# Altium schematic sheet 5_LCD.SchDoc
size A; SheetNumber: 5; SheetTotal: 5
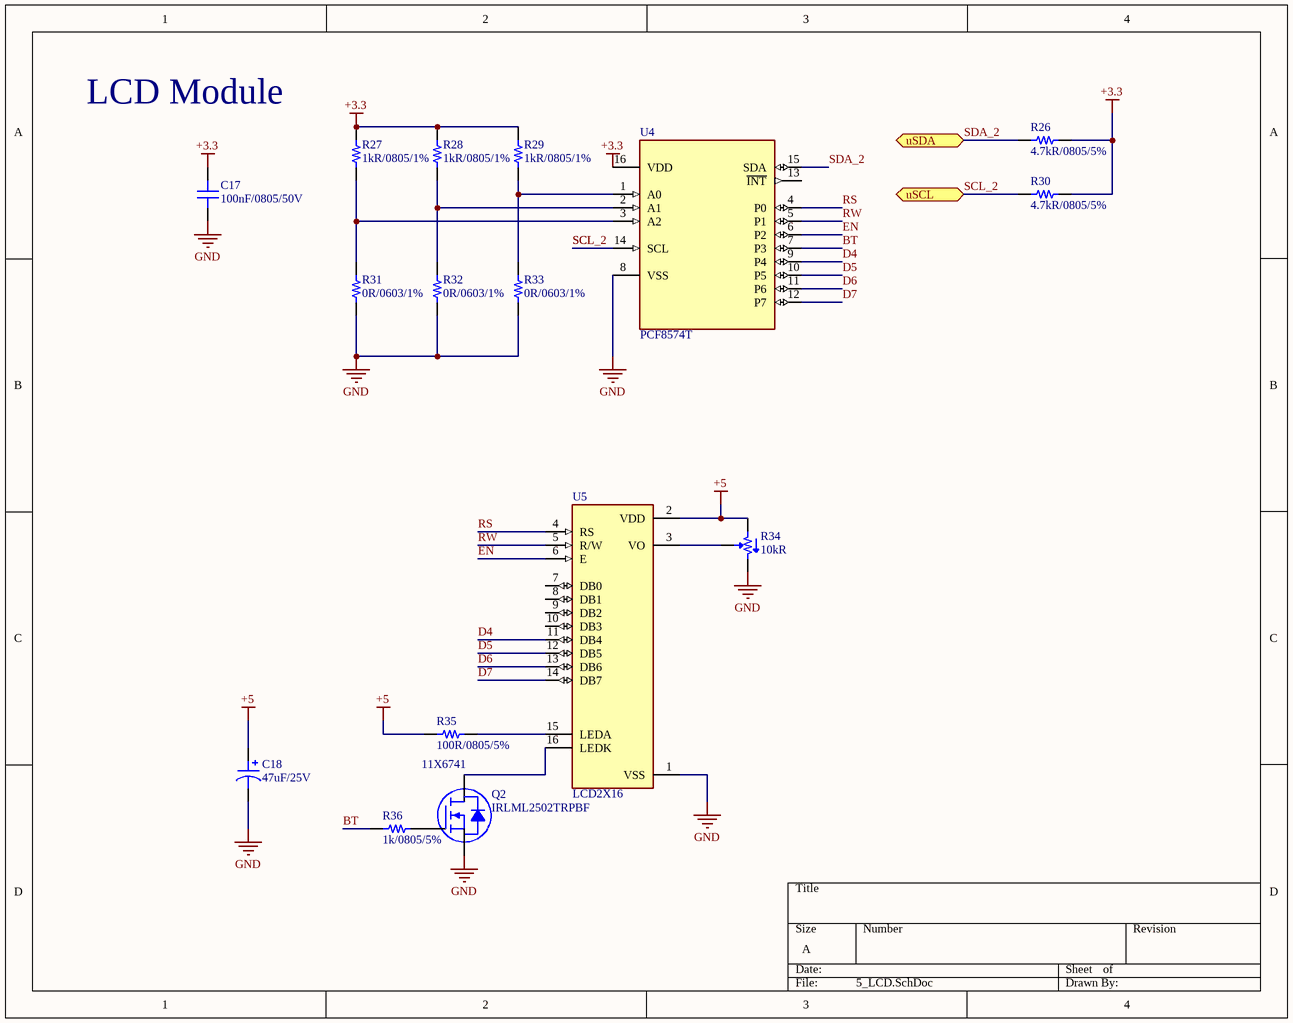
[diagram p0: 5_LCD.SchDoc]

## Parts
C17  100nF/0805/50V  [CAP FILM 0805]
C18  47uF/25V  [CAP ALSMD 6.6MM H5.4MM]
Q2  IRLML2502TRPBF  Supplier Part Number 1: 11X6741  [TI SOT-23-3 DBZ]
R26  4.7kR/0805/5%  [RES 0805_2012]
R27  1kR/0805/1%  [RES 0805_2012]
R28  1kR/0805/1%  [RES 0805_2012]
R29  1kR/0805/1%  [RES 0805_2012]
R30  4.7kR/0805/5%  [RES 0805_2012]
R31  0R/0603/1%  [RES 0603_1608]
R32  0R/0603/1%  [RES 0603_1608]
R33  0R/0603/1%  [RES 0603_1608]
R34  10kR  [POT Panasonic EVM]
R35  100R/0805/5%  [RES 0805_2012]
R36  1k/0805/5%  [RES 0805_2012]
U4  PCF8574T  [SOIC127P1032X265-16N]
U5  LCD2X16  [LCD_LCD2X16]

## Ports
uSCL (bidir), uSDA (bidir)

## Nets
+3.3: C17.2 R26.2 R27.2 R28.2 R29.2 R30.2 U4.16(VDD)
+5: C18.1 R34.1 R35.1 U5.2(VDD)
GND: C17.1 C18.2 Q2.2(S) R31.1 R32.1 R33.1 R34.3 U4.8(VSS) U5.1(VSS)
BT: R36.2 U4.7(P3)
D4: U4.9(P4) U5.11(DB4)
D5: U4.10(P5) U5.12(DB5)
D6: U4.11(P6) U5.13(DB6)
D7: U4.12(P7) U5.14(DB7)
EN: U4.6(P2) U5.6(E)
RS: U4.4(P0) U5.4(RS)
RW: U4.5(P1) U5.5(R/W)
SCL: R30.1 U4.14(SCL) ; port uSCL  [also labelled SCL_2]
SDA_2: R26.1 U4.15(SDA) ; port uSDA
NetQ2_1: Q2.1(G) R36.1
NetQ2_3: Q2.3(D) U5.16(LEDK)
NetR27_1: R27.1 R31.2 U4.3(A2)
NetR28_1: R28.1 R32.2 U4.2(A1)
NetR29_1: R29.1 R33.2 U4.1(A0)
NetR34_2: R34.2 U5.3(VO)
NetR35_2: R35.2 U5.15(LEDA)

Not connected (* = marked no-connect by the designer): U4 13(~{INT}); U5 7(DB0) 8(DB1) 9(DB2) 10(DB3)

## Notes on the sheet
- LCD Module

## Library data of the parts
C17 = Capacitor - MLCC: Multilayer Ceramic Capacitor, 0.1 uF, 50 V, ï¿½ 10%, X7R, 0805 [2012 Metric]; Manufacturer: Samsung; Manufacturer Part Number: CL21B104KBCNNNC; Capacitance: 100nF; Voltage Rating: 50V; Supplier 1: Avnet; Supplier Part Number 1: CL21B104KBCNNNC; RoHS: Yes; Category: Ceramic Capacitors; Stock 1: 850000; Pricing 1: 4000=0.0097, 8000=0.00455, 16000=0.00444, 24000=0.00434, 32000=0.00423 (USD); Mount: Surface Mount; Case/Package: 0805; Case Code (Metric): 2012; Case Code (Imperial): 0805; Material: Ceramic; Min Operating Temperature: -55°C; Max Operating Temperature: 125°C; Tolerance: 10%; Dielectric: X7R; Packaging: Tape and Reel; Voltage: 50V; Series: CL; Construction: Flat; Voltage Rating (DC): 50V; Length: 2mm; Width: 0.049inch; Height: 0.85mm; Depth: 1.25mm; Thickness: 0.037inch; Radiation Hardening: No; RoHS Compliant: Yes; Lead Free: 5697LeadFree; ComponentLink1URL: https://datasheet.ciiva.com/25710/cl21b104kbcnnnc-25710182.pdf?src-supplier=Digikey; ComponentLink1Description: https://datasheet.ciiva.com/25710/cl21b104kbcnnnc-25710182.pdf?src-supplier=Digikey; ComponentLink2URL: https://datasheet.ciiva.com/29199/454152-da-01-en-vs-kondensator-0805-29199814.pdf?src-supplier=Conrad; ComponentLink2Description: https://datasheet.ciiva.com/29199/454152-da-01-en-vs-kondensator-0805-29199814.pdf?src-supplier=Conrad
C18 = Capacitor - Aluminum: SMT Polarised Capacitor
Q2 = MOSFET N-CH: Mosfet, Power; N-ch; Vdss 20V; Rds(on) 0.035 Ohm; Id 4.2A; MICRO3; Pd 1.25W; Vgs +/-12V; Manufacturer: International Rectifier; Nominal Vgs: 1.2V; Drain-source On Resistance-Max: 45mR; Supplier 1: Newark; Manufacturer Part Number: IRLML2502TRPBF; RoHS: Yes; Category: Uncategorized; Case/Package: SOT-23; Number of Pins: 3; Min Operating Temperature: -55°C; Max Operating Temperature: 150°C; Drain to Source Voltage (Vdss): 20V; Continuous Drain Current (ID): 4.2A; Voltage Rating (DC): 20V; Current Rating: 4.2A; Dual Supply Voltage: 20V; Threshold Voltage: 1.2V; Termination: SMD/SMT; Max Power Dissipation: 1.25W; RoHS Compliant: Yes; Lead Free: Lead Free; Reach SVHC Compliant: No; ComponentLink1URL: https://datasheet.ciiva.com/36526/1563649-36526014.pdf?src-supplier=Jameco; ComponentLink1Description: https://datasheet.ciiva.com/36526/1563649-36526014.pdf?src-supplier=Jameco; ComponentLink2URL: https://datasheet.ciiva.com/16425/irlml2502pbf-16425943.pdf?src-supplier=Future+Electronics; ComponentLink2Description: https://datasheet.ciiva.com/16425/irlml2502pbf-16425943.pdf?src-supplier=Future+Electronics; ComponentLink3URL: https://datasheet.ciiva.com/6156/irlml2502-6156070.pdf?src-supplier=Farnell; ComponentLink3Description: https://datasheet.ciiva.com/6156/irlml2502-6156070.pdf?src-supplier=Farnell; ComponentLink4URL: https://datasheet.ciiva.com/7935/irlml2502-7935685.pdf?src-supplier=Element14; ComponentLink4Description: https://datasheet.ciiva.com/7935/irlml2502-7935685.pdf?src-supplier=Element14
R26 R30 = Resistor: SMD Chip Resistor, 4.7 kOhm, ± 5%, 125 mW, 0805 [2012 Metric], Thick Film, General Purpose; Manufacturer: Vishay Dale; Manufacturer Part Number: CRCW08054K70JNEA; Resistance: 4.7kR; Power Rating: 125mW; Voltage Rating: 150V; Temperature Coefficient: 200ppm/°C; Supplier 1: Mouser; Supplier Part Number 1: 71-CRCW0805J-4.7K-E3; RoHS: Yes; Category: Chip SMD Resistors; Stock 1: 11837; Pricing 1: 1=0.1, 10=0.022, 50=0.022, 100=0.015, 1000=0.012, 10000=0.005 (USD); Case/Package: 0805; Weight: 0.000194oz; Case Code (Imperial): 0805; Case Code (Metric): 2012; Contact Plating: Tin; Size Code: 0805; Min Operating Temperature: -55°C; Max Operating Temperature: 155°C; Packaging: Tape and Reel; Tolerance: 5%; Package Quantity: 5000; Termination: SMD/SMT; Features: Automotive AEC-Q200; Series: CRCW; Max Power Dissipation: 125mW; Number of Terminations: 2; Resistor Type: Thick Film; Construction: Rectangular; Resistance Tolerance: 5%; Technology: THICK FILM; Length: 2mm; Width: 1.25mm; Height: 0.45mm; Depth: 1.25mm; Radiation Hardening: No; RoHS Compliant: Yes; Lead Free: 5697LeadFree; Military Standard: Not; Reach SVHC Compliant: Unknown; ComponentLink1URL: https://datasheet.ciiva.com/28606/1912744-28606777.pdf?src-supplier=Element14; ComponentLink1Description: https://datasheet.ciiva.com/28606/1912744-28606777.pdf?src-supplier=Element14; ComponentLink2URL: https://datasheet.ciiva.com/9071/dcrcwe3-9071273.pdf?src-supplier=Avnet; ComponentLink2Description: https://datasheet.ciiva.com/9071/dcrcwe3-9071273.pdf?src-supplier=Avnet; ComponentLink3URL: https://datasheet.ciiva.com/16786/70201119-16786966.pdf?src-supplier=Allied+Electronics; ComponentLink3Description: https://datasheet.ciiva.com/16786/70201119-16786966.pdf?src-supplier=Allied+Electronics
R27-R29 = Resistor: SMD Chip Resistor, 1 kOhm, ï¿½ 1%, 125 mW, 0805 [2012 Metric], Thick Film, General Purpose; Manufacturer: Yageo; Manufacturer Part Number: RC0805FR-071KL; Resistance: 1kR; Voltage Rating (DC): 150V; Temperature Coefficient: 100ppm/°C; Power Rating: 125mW; Supplier 1: Future Electronics; Supplier Part Number 1: 8126013; RoHS: Yes; Category: Chip SMD Resistors; Stock 1: 1010000; Pricing 1: 5000=0.0032, 25000=0.003, 100000=0.0029, 250000=0.0028, 625000=0.0027 (USD); Case/Package: 0805; Number of Pins: 2; Case Code (Metric): 2012; Case Code (Imperial): 0805; Size Code: 0805; Min Operating Temperature: -55°C; Max Operating Temperature: 155°C; Tolerance: 1%; Packaging: Tape and Reel; Resistor Type: Thick Film; Package Quantity: 1; Voltage Rating: 150V; Termination: SMD/SMT; Series: RC; Number of Terminations: 2; Max Power Dissipation: 125mW; Features: Moisture Resistant; Resistance Tolerance: 1%; Construction: Rectangular; Voltage Rating (AC): 150V; Length: 0.079inch; Width: 0.049inch; Height: 0.024inch; Depth: 1.25mm; Reach SVHC Compliant: No; RoHS Compliant: Yes; Lead Free: 5697LeadFree; Military Standard: Not; ComponentLink1URL: https://datasheet.ciiva.com/7941/1686128-7941719.pdf?src-supplier=Element14; ComponentLink1Description: https://datasheet.ciiva.com/7941/1686128-7941719.pdf?src-supplier=Element14; ComponentLink2URL: https://datasheet.ciiva.com/46385/444164-46385020.pdf?src-supplier=Element14; ComponentLink2Description: https://datasheet.ciiva.com/46385/444164-46385020.pdf?src-supplier=Element14; ComponentLink3URL: https://datasheet.ciiva.com/2456/pyu-r-int-thick-7-2456976.pdf?src-supplier=Digikey; ComponentLink3Description: https://datasheet.ciiva.com/2456/pyu-r-int-thick-7-2456976.pdf?src-supplier=Digikey; ComponentLink4URL: https://datasheet.ciiva.com/2456/pyu-r-int-thick-7-2456977.pdf?src-supplier=Digikey; ComponentLink4Description: https://datasheet.ciiva.com/2456/pyu-r-int-thick-7-2456977.pdf?src-supplier=Digikey; ComponentLink5URL: https://datasheet.ciiva.com/2456/pyu-r-int-thick-7-2456975.pdf?src-supplier=Digikey; ComponentLink5Description: https://datasheet.ciiva.com/2456/pyu-r-int-thick-7-2456975.pdf?src-supplier=Digikey; ComponentLink6URL: https://datasheet.ciiva.com/16850/rc0805-16850409.pdf?src-supplier=Future+Electronics; ComponentLink6Description: https://datasheet.ciiva.com/16850/rc0805-16850409.pdf?src-supplier=Future+Electronics
R31-R33 = Resistor: SMD Chip Resistor, 1 kOhm, ï¿½ 1%, 125 mW, 0805 [2012 Metric], Thick Film, General Purpose; Manufacturer: Yageo; Manufacturer Part Number: RC0805FR-071KL; Resistance: 0R; Voltage Rating (DC): 150V; Temperature Coefficient: 100ppm/°C; Power Rating: 125mW; Supplier 1: Future Electronics; Supplier Part Number 1: 8126013; RoHS: Yes; Category: Chip SMD Resistors; Stock 1: 1010000; Pricing 1: 5000=0.0032, 25000=0.003, 100000=0.0029, 250000=0.0028, 625000=0.0027 (USD); Case/Package: 0603; Number of Pins: 2; Case Code (Metric): 2012; Case Code (Imperial): 0805; Size Code: 0805; Min Operating Temperature: -55°C; Max Operating Temperature: 155°C; Tolerance: 1%; Packaging: Tape and Reel; Resistor Type: Thick Film; Package Quantity: 1; Voltage Rating: 150V; Termination: SMD/SMT; Series: RC; Number of Terminations: 2; Max Power Dissipation: 125mW; Features: Moisture Resistant; Resistance Tolerance: 1%; Construction: Rectangular; Voltage Rating (AC): 150V; Length: 0.079inch; Width: 0.049inch; Height: 0.024inch; Depth: 1.25mm; Reach SVHC Compliant: No; RoHS Compliant: Yes; Lead Free: 5697LeadFree; Military Standard: Not; ComponentLink1URL: https://datasheet.ciiva.com/7941/1686128-7941719.pdf?src-supplier=Element14; ComponentLink1Description: https://datasheet.ciiva.com/7941/1686128-7941719.pdf?src-supplier=Element14; ComponentLink2URL: https://datasheet.ciiva.com/46385/444164-46385020.pdf?src-supplier=Element14; ComponentLink2Description: https://datasheet.ciiva.com/46385/444164-46385020.pdf?src-supplier=Element14; ComponentLink3URL: https://datasheet.ciiva.com/2456/pyu-r-int-thick-7-2456976.pdf?src-supplier=Digikey; ComponentLink3Description: https://datasheet.ciiva.com/2456/pyu-r-int-thick-7-2456976.pdf?src-supplier=Digikey; ComponentLink4URL: https://datasheet.ciiva.com/2456/pyu-r-int-thick-7-2456977.pdf?src-supplier=Digikey; ComponentLink4Description: https://datasheet.ciiva.com/2456/pyu-r-int-thick-7-2456977.pdf?src-supplier=Digikey; ComponentLink5URL: https://datasheet.ciiva.com/2456/pyu-r-int-thick-7-2456975.pdf?src-supplier=Digikey; ComponentLink5Description: https://datasheet.ciiva.com/2456/pyu-r-int-thick-7-2456975.pdf?src-supplier=Digikey; ComponentLink6URL: https://datasheet.ciiva.com/16850/rc0805-16850409.pdf?src-supplier=Future+Electronics; ComponentLink6Description: https://datasheet.ciiva.com/16850/rc0805-16850409.pdf?src-supplier=Future+Electronics
R34 = Potentiometer: Res Cermet Trimmer 10K Ohm 25% 3/20W 1Turn Foot Print SMD Carrier T/R; Manufacturer: Panasonic; Manufacturer Part Number: EVM-2WSX80B14; Power Rating: 150mW; Voltage Rating: 50V; Number of Turns: 1; Temperature Coefficient: 250ppm/°C; Supplier 1: Farnell; Supplier Part Number 1: 1849772RL; RoHS: Yes; Category: Variable Resistors and Potentiometers; Pricing 1: 3000=0.172 (GBP); Mount: Surface Mount; Color: Silver; Min Operating Temperature: -40°C; Max Operating Temperature: 100°C; Resistance: 10kR; Tolerance: 25%; Packaging: Tape and Reel; Package Quantity: 1; Resistor Type: Cermet; Termination: SMD/SMT; Taper: Linear; Max Power Dissipation: 150mW; Series: EVM; Resistance Tolerance: 25%; Technology: CERMET; Length: 2.75mm; Width: 2.2mm; Height: 1.05mm; Depth: 2.75mm; Radiation Hardening: No; Lead Free: Lead Free; RoHS Compliant: Yes; ComponentLink1URL: https://datasheet.ciiva.com/11833/0900766b80f7f9dc-11833154.pdf?src-supplier=Rs; ComponentLink1Description: https://datasheet.ciiva.com/11833/0900766b80f7f9dc-11833154.pdf?src-supplier=Rs; ComponentLink2URL: https://datasheet.ciiva.com/7655/730973-7655221.pdf?src-supplier=Element14; ComponentLink2Description: https://datasheet.ciiva.com/7655/730973-7655221.pdf?src-supplier=Element14; ComponentLink3URL: https://datasheet.ciiva.com/8096/aoi0000ce1-8096841.pdf?src-supplier=Avnet; ComponentLink3Description: https://datasheet.ciiva.com/8096/aoi0000ce1-8096841.pdf?src-supplier=Avnet; ComponentLink4URL: https://datasheet.ciiva.com/2155/aoi0000ce1-2155668.pdf?src-supplier=Digikey; ComponentLink4Description: https://datasheet.ciiva.com/2155/aoi0000ce1-2155668.pdf?src-supplier=Digikey; ComponentLink5URL: https://datasheet.ciiva.com/2155/aoi0000ce1-2155669.pdf?src-supplier=Digikey; ComponentLink5Description: https://datasheet.ciiva.com/2155/aoi0000ce1-2155669.pdf?src-supplier=Digikey; ComponentLink6URL: https://datasheet.ciiva.com/2155/aoi0000ce1-2155667.pdf?src-supplier=Digikey; ComponentLink6Description: https://datasheet.ciiva.com/2155/aoi0000ce1-2155667.pdf?src-supplier=Digikey
R35 = Resistor: SMD Chip Resistor, 100 Ohm, ± 5%, 125 mW, 0805 [2012 Metric], Thick Film, General Purpose; Manufacturer: Yageo; Manufacturer Part Number: AC0805JR-07100RL; Resistance: 100R; Supplier 1: Future Electronics; Supplier Part Number 1: 4083153; RoHS: Yes; Category: Chip SMD Resistors; Stock 1: 295000; Pricing 1: 5000=0.004, 25000=0.0038, 100000=0.0037, 250000=0.0036, 625000=0.0034 (USD); ComponentLink1URL: http://www.mouser.com/ds/2/447/yageodocoutput-1111992.pdf?src-supplier=Mouser; ComponentLink1Description: http://www.mouser.com/ds/2/447/yageodocoutput-1111992.pdf?src-supplier=Mouser; ComponentLink2URL: https://www.yageo.com/upload/media/product/productsearch/datasheet/rchip/PYu-AC_51_RoHS_L_7.pdf?src-supplier=Digikey; ComponentLink2Description: https://www.yageo.com/upload/media/product/productsearch/datasheet/rchip/PYu-AC_51_RoHS_L_7.pdf?src-supplier=Digikey; ComponentLink3URL: http://www.yageo.com/NewPortal/yageodocoutput?fileName=/pdf/R-Chip/PYu-AC_51_RoHS_L_6.pdf&src-supplier=Digikey; ComponentLink3Description: http://www.yageo.com/NewPortal/yageodocoutput?fileName=/pdf/R-Chip/PYu-AC_51_RoHS_L_6.pdf&src-supplier=Digikey; ComponentLink4URL: https://datasheet.octopart.com/AC0805JR-07100RL-Yageo-datasheet-151884373.pdf?src-supplier=Future+Electronics; ComponentLink4Description: https://datasheet.octopart.com/AC0805JR-07100RL-Yageo-datasheet-151884373.pdf?src-supplier=Future+Electronics; Case/Package: 0805; Tolerance: 5%
R36 = Resistor: Res Thin Film 0805 2K Ohm 0.1% 0.125W(1/8W) ±25ppm/C Pad SMD T/R; Manufacturer: Yageo; Manufacturer Part Number: RT0805BRD072KL; Voltage Rating (DC): 150V; Resistance: 1k; Tolerance: 5%; Supplier 1: Future Electronics; Supplier Part Number 1: 9309717; RoHS: Yes; Category: Chip SMD Resistors; Stock 1: 35000; Pricing 1: 5000=0.0215, 15000=0.0207, 25000=0.0203, 75000=0.0196, 125000=0.019 (USD); Lead Free: 5697LeadFree; ComponentLink1URL: https://datasheet.ciiva.com/12836/pyu-rt-1-to-0-05-rohs-l-4-12836431.pdf?src-supplier=Mouser; ComponentLink1Description: https://datasheet.ciiva.com/12836/pyu-rt-1-to-0-05-rohs-l-4-12836431.pdf?src-supplier=Mouser; ComponentLink2URL: https://datasheet.ciiva.com/8894/pyu-rt-1-to-0-05-rohs-l-4-8894822.pdf?src-supplier=Avnet; ComponentLink2Description: https://datasheet.ciiva.com/8894/pyu-rt-1-to-0-05-rohs-l-4-8894822.pdf?src-supplier=Avnet; ComponentLink3URL: https://datasheet.ciiva.com/2584/pyu-rt-1-to-0-05-rohs-l-4-2584929.pdf?src-supplier=Digikey; ComponentLink3Description: https://datasheet.ciiva.com/2584/pyu-rt-1-to-0-05-rohs-l-4-2584929.pdf?src-supplier=Digikey; ComponentLink4URL: https://datasheet.ciiva.com/46634/pyu-rt-1-to-0-05-rohs-l-5-46634903.pdf?src-supplier=Digikey; ComponentLink4Description: https://datasheet.ciiva.com/46634/pyu-rt-1-to-0-05-rohs-l-5-46634903.pdf?src-supplier=Digikey; Case/Package: 0805
U4 = PCF8574T: I/O Expander 8 IÂ²C 100 kHz 20-SSOP; MF: NXP Semiconductors; MP: PCF8574T; Price: None; Availability: In Stock; Package: SOIC-16 NXP Semiconductors; Purchase-URL: https://pricing.snapeda.com/search/part/PCF8574T/?ref=eda; SnapEDA_Link: https://www.snapeda.com/parts/PCF8574T/NXP+Semiconductors/view-part/?ref=snap; Value: *; Check_prices: https://www.snapeda.com/parts/PCF8574T/NXP+Semiconductors/view-part/?ref=eda
U5 = LCD2X16: Display; Display: LCD 2x16 characters (blue backlight); Price: None; Value: *; MP: LCD2X16; Package: None; Availability: Unavailable